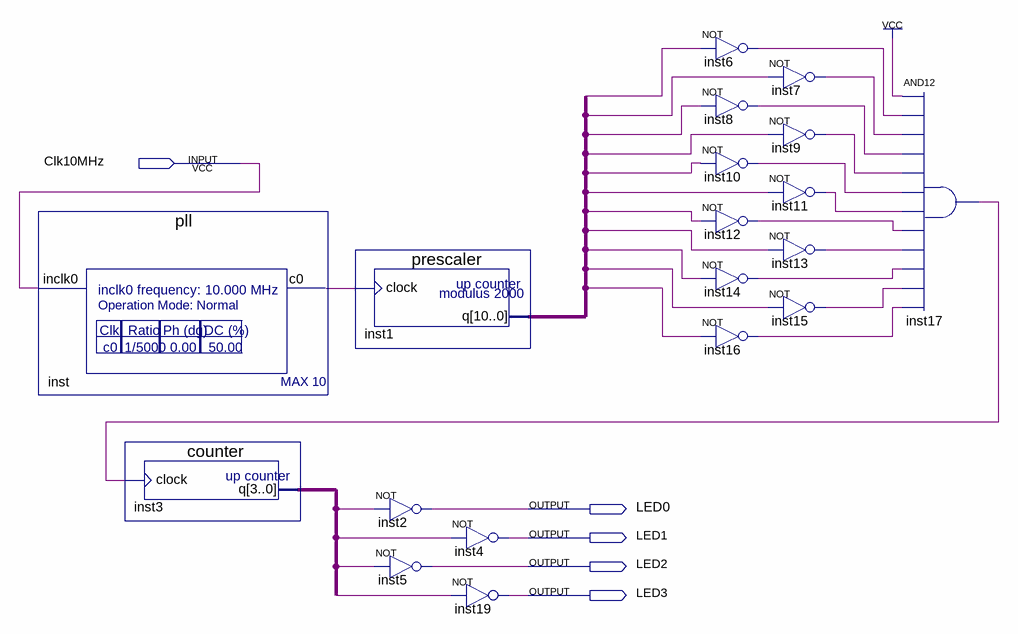
[diagram p0: schematic sheet]
// Quartus schematic 01-Basic_Counter_IP.bdf as structural Verilog: 19 symbols, 5 pins
module \01-Basic_Counter_IP  (
  input  Clk10MHz,
  output LED0,
  output LED1,
  output LED2,
  output LED3
);

  wire inst6_out, inst7_out, inst8_out, inst9_out, inst10_out, inst11_out, inst12_out, inst13_out,
       inst14_out, inst15_out, inst16_out, inst17_out, inst_c0;
  wire [3:0] o;
  wire [10:0] q;

  pll inst (.inclk0(Clk10MHz), .c0(inst_c0));
  counter inst3 (.clock(inst17_out), .q(o));
  prescaler inst1 (.clock(inst_c0), .q(q));
  not inst2 (LED0, o[0]);
  not inst5 (LED2, o[2]);
  not inst4 (LED1, o[1]);
  not inst19 (LED3, o[3]);
  not inst6 (inst6_out, q[0]);
  not inst8 (inst8_out, q[2]);
  not inst10 (inst10_out, q[4]);
  not inst12 (inst12_out, q[6]);
  not inst14 (inst14_out, q[8]);
  not inst16 (inst16_out, q[10]);
  not inst7 (inst7_out, q[1]);
  not inst9 (inst9_out, q[3]);
  not inst11 (inst11_out, q[5]);
  not inst13 (inst13_out, q[7]);
  not inst15 (inst15_out, q[9]);
  and inst17 (inst17_out, 1'b1, inst6_out, inst7_out, inst8_out, inst9_out, inst10_out, inst11_out, inst12_out, inst13_out, inst14_out, inst15_out, inst16_out);
endmodule
